# Altium schematic sheet ADC+Temp.SchDoc
size A3; SheetNumber: 5; SheetTotal: 10
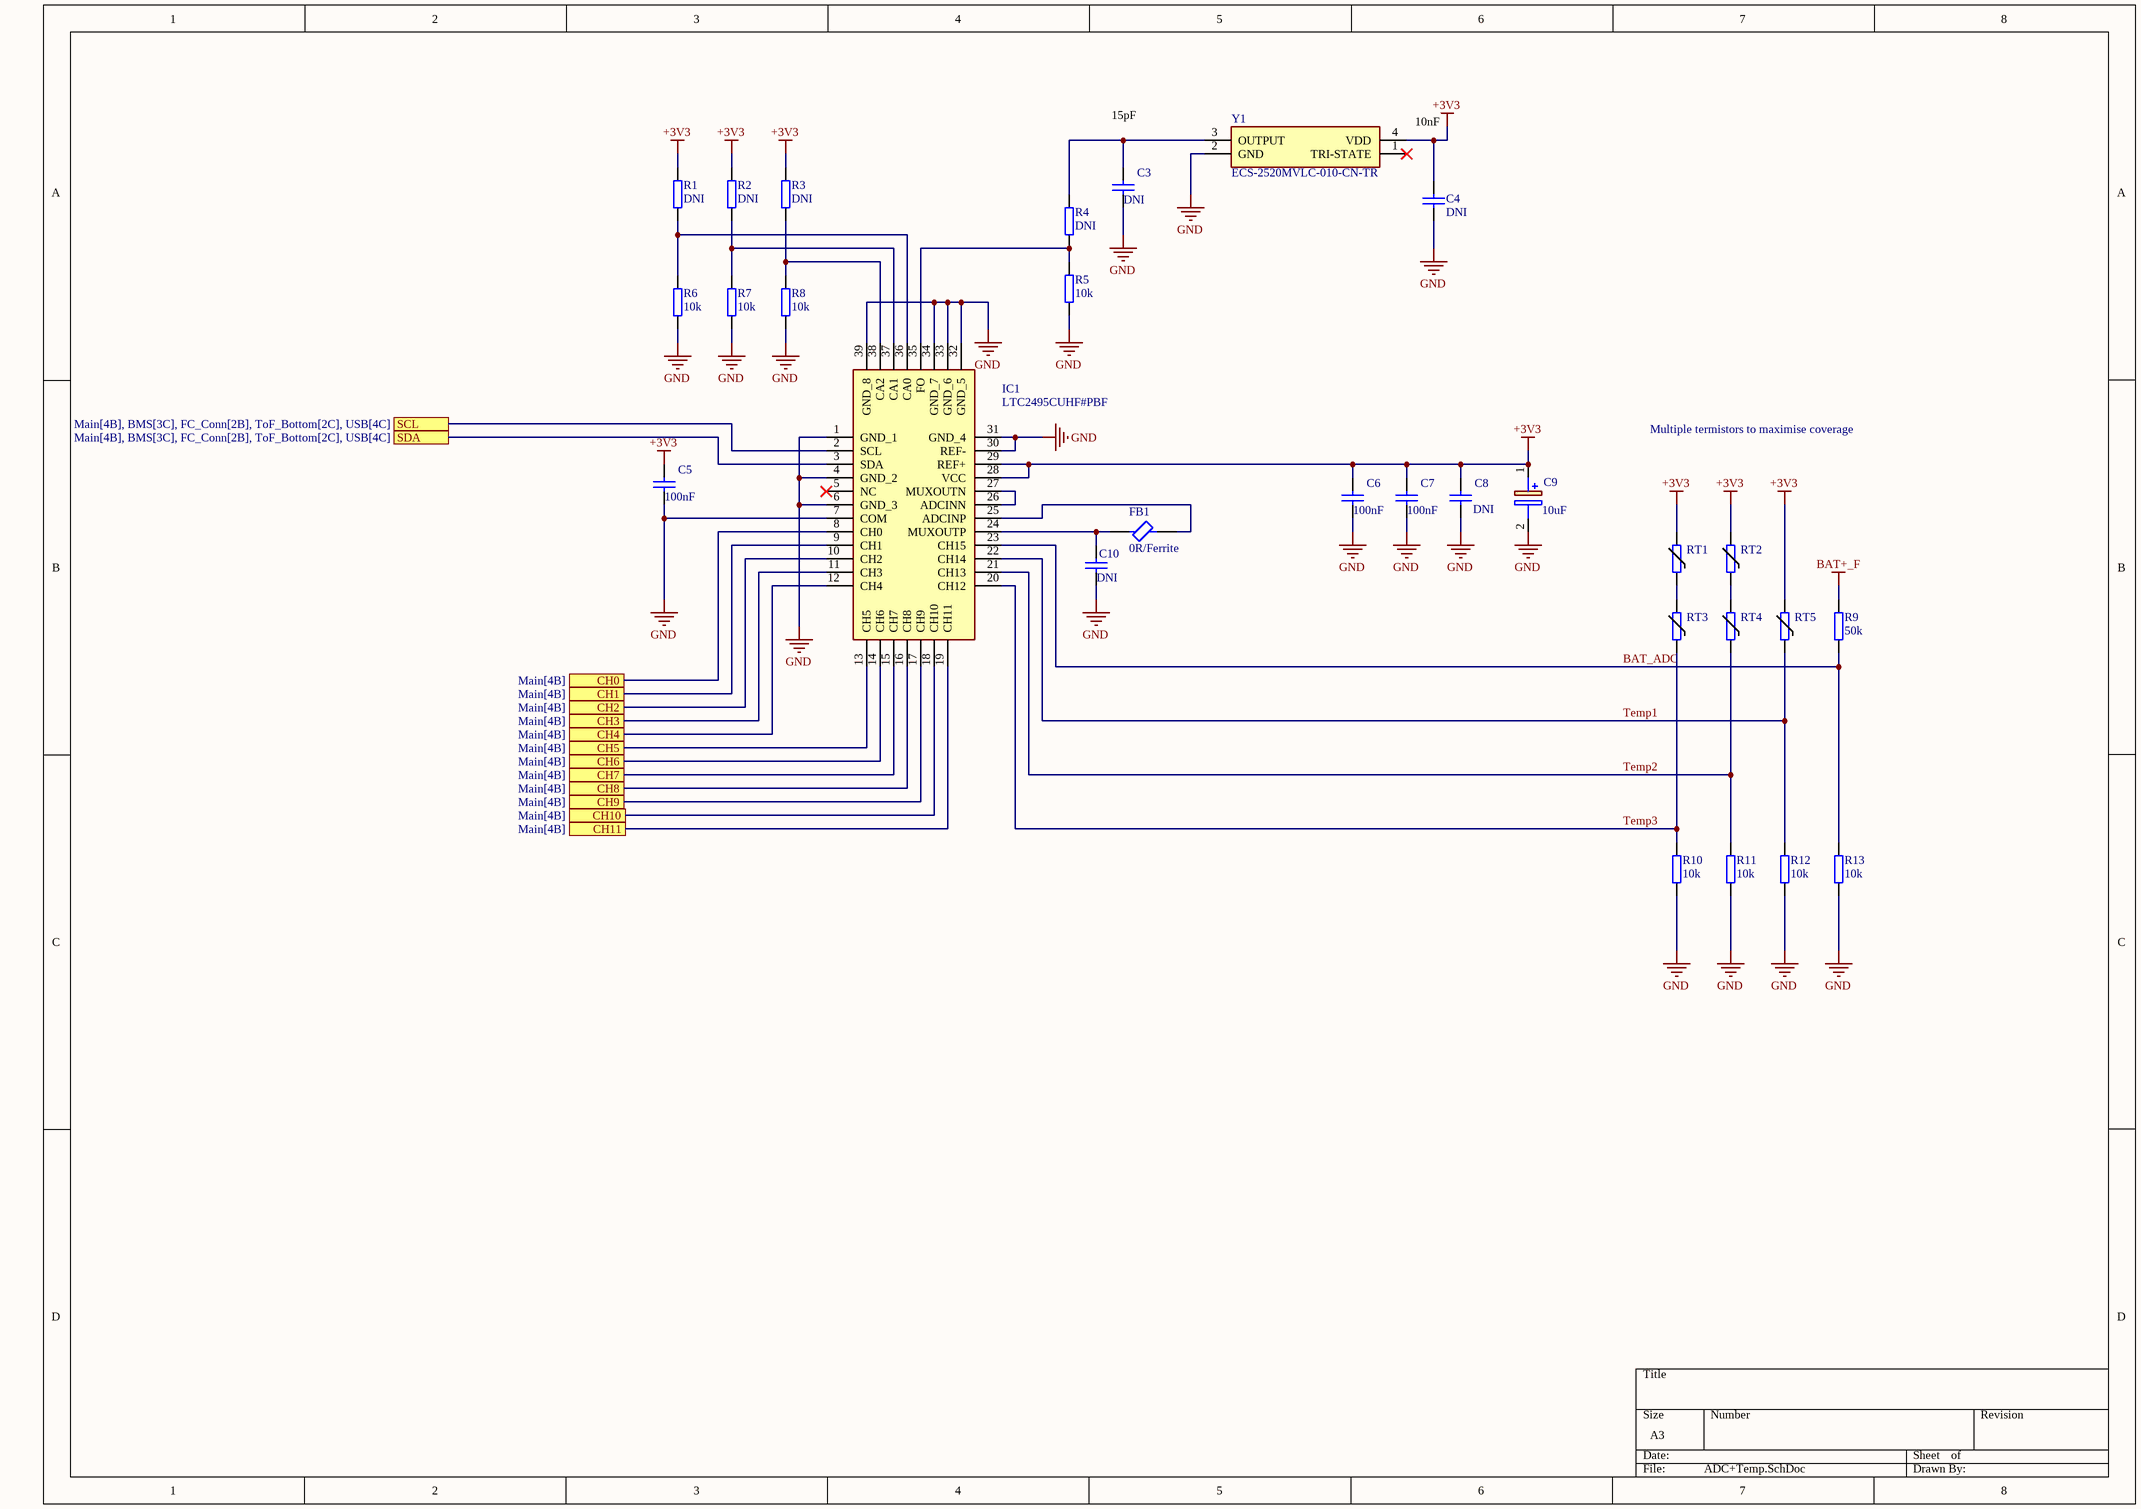
[diagram p0: ADC+Temp.SchDoc]

## Parts
C3  value DNI  [CAP0402]  (hidden comment: Cap0402)
C4  value DNI  [CAP0402]  (hidden comment: Cap0402)
C5  value 100nF  [CAP0402]  (hidden comment: Cap0402)
C6  value 100nF  [CAP0402]  (hidden comment: Cap0402)
C7  value 100nF  [CAP0402]  (hidden comment: Cap0402)
C8  value DNI  [CAP0603]  (hidden comment: Cap0603)
C9  value 10uF  [CAPPC1608X90N]  (hidden comment: TMCJ0J106MTRF)
C10  value DNI  [CAP0402]  (hidden comment: Cap0402)
FB1  0R/Ferrite  [NFZ15SG152SN10B]
IC1  LTC2495CUHF#PBF  [QFN50P500X700X80-39N-D]
R1  value DNI  [RES0402]  (hidden comment: Res0402)
R2  value DNI  [RES0402]  (hidden comment: Res0402)
R3  value DNI  [RES0402]  (hidden comment: Res0402)
R4  value DNI  [RES0402]  (hidden comment: Res0402)
R5  value 10k  [RES0402]  (hidden comment: Res0402)
R6  value 10k  [RES0402]  (hidden comment: Res0402)
R7  value 10k  [RES0402]  (hidden comment: Res0402)
R8  value 10k  [RES0402]  (hidden comment: Res0402)
R9  value 50k  [RES0402]  (hidden comment: Res0402)
R10  value 10k  [RES0402]  (hidden comment: Res0402)
R11  value 10k  [RES0402]  (hidden comment: Res0402)
R12  value 10k  [RES0402]  (hidden comment: Res0402)
R13  value 10k  [RES0402]  (hidden comment: Res0402)
RT1  TMP6131DECR  [TMP6131DECR]  (value not drawn)
RT2  TMP6131DECR  [TMP6131DECR]  (value not drawn)
RT3  TMP6131DECR  [TMP6131DECR]  (value not drawn)
RT4  TMP6131DECR  [TMP6131DECR]  (value not drawn)
RT5  TMP6131DECR  [TMP6131DECR]  (value not drawn)
Y1  ECS-2520MVLC-010-CN-TR  [ECS2520MVLC010CNTR]

## Ports
CH0 (see Main[4B]), CH1 (see Main[4B]), CH2 (see Main[4B]), CH3 (see Main[4B]), CH4 (see Main[4B]), CH5 (see Main[4B]), CH6 (see Main[4B]), CH7 (see Main[4B]), CH8 (see Main[4B]), CH9 (see Main[4B]), CH10 (see Main[4B]), CH11 (see Main[4B]), SCL (see Main[4B], BMS[3C], FC_Conn[2B], ToF_Bottom[2C], USB[4C]), SDA (see Main[4B], BMS[3C], FC_Conn[2B], ToF_Bottom[2C], USB[4C])

## Nets
+3V3: C4.2 C5.2 C6.2 C7.2 C8.2 C9.1(+) IC1.28(VCC) IC1.29(REF+) R1.2 R2.2 R3.2 RT1.2 RT2.2 RT5.2 Y1.4(VDD)
BAT+_F: R9.2
GND: C3.1 C4.1 C5.1 C6.1 C7.1 C8.1 C9.2(-) C10.1 IC1.1(GND_1) IC1.4(GND_2) IC1.6(GND_3) IC1.7(COM) IC1.30(REF-) IC1.31(GND_4) IC1.32(GND_5) IC1.33(GND_6) IC1.34(GND_7) IC1.39(GND_8) R5.1 R6.1 R7.1 R8.1 R10.1 R11.1 R12.1 R13.1 Y1.2(GND)
BAT_ADC: IC1.23(CH15) R9.1 R13.2
CH0: IC1.8(CH0) ; port CH0
CH1: IC1.9(CH1) ; port CH1
CH2: IC1.10(CH2) ; port CH2
CH3: IC1.11(CH3) ; port CH3
CH4: IC1.12(CH4) ; port CH4
CH5: IC1.13(CH5) ; port CH5
CH6: IC1.14(CH6) ; port CH6
CH7: IC1.15(CH7) ; port CH7
CH8: IC1.16(CH8) ; port CH8
CH9: IC1.17(CH9) ; port CH9
CH10: IC1.18(CH10) ; port CH10
CH11: IC1.19(CH11) ; port CH11
SCL: IC1.2(SCL) ; port SCL
SDA: IC1.3(SDA) ; port SDA
Temp1: IC1.22(CH14) R12.2 RT5.1
Temp2: IC1.21(CH13) R11.2 RT4.1
Temp3: IC1.20(CH12) R10.2 RT3.1
NetC3_2: C3.2 R4.2 Y1.3(OUTPUT)
NetC10_2: C10.2 FB1.1 IC1.24(MUXOUTP)
NetFB1_2: FB1.2 IC1.25(ADCINP)
NetIC1_26: IC1.26(ADCINN) IC1.27(MUXOUTN)
NetIC1_35: IC1.35(FO) R4.1 R5.2
NetIC1_36: IC1.36(CA0) R1.1 R6.2
NetIC1_37: IC1.37(CA1) R2.1 R7.2
NetIC1_38: IC1.38(CA2) R3.1 R8.2
NetRT1_1: RT1.1 RT3.2
NetRT2_1: RT2.1 RT4.2

Not connected (* = marked no-connect by the designer): IC1 5(NC)*; Y1 1(TRI-STATE)*

## Notes on the sheet
- 15pF
- (near Y1) 10nF
- Multiple termistors to maximise coverage

## Library data of the parts
C5-C7 = Cap0402: Manufacturer_Part_Number: GRM155R71H104ME14D; Voltage: 50V
C9 = 298D106X96R3M2T: Capacitor Polarised; Voltage: 6V3; Manufacturer_Part_Number: TMCJ0J106MTRF
FB1 = BLM15PE471SH1D: Ferrite Bead; Manufacturer_Name: Murata Electronics; Datasheet Link: https://www.murata.com/en-global/products/productdetail.aspx?cate=luNoiseSupprFilteChipFerriBead&partno=BLM15PE471SH1%23; Height: 0.55mm; Manufacturer_Part_Number: BLM15PE471SH1D; Mouser Part Number: 81-BLM15PE471SH1D; Mouser Price/Stock: https://www.mouser.co.uk/ProductDetail/Murata-Electronics/BLM15PE471SH1D?qs=DRkmTr78QATAY5qAVx1hGA%3D%3D
IC1 = LTC2495CUHF#PBF: Integrated Circuit; Manufacturer_Name: Analog Devices; Datasheet Link: https://www.analog.com/media/en/technical-documentation/data-sheets/2495fe.pdf; Height: 0.8mm; Manufacturer_Part_Number: LTC2495CUHF#PBF; Mouser Part Number: 584-LTC2495CUHF#PBF; Mouser Price/Stock: https://www.mouser.co.uk/ProductDetail/Analog-Devices/LTC2495CUHFPBF?qs=hVkxg5c3xu%252Bd9nHQ1gaMcw%3D%3D; Arrow Part Number: LTC2495CUHF#PBF; Arrow Price/Stock: https://www.arrow.com/en/products/ltc2495cuhfpbf/analog-devices?region=europe
R5-R8 R10-R13 = Res0402: Manufacturer_Part_Number: ERA-2AED103X
R9 = Res0402: Manufacturer_Part_Number: TNPW040249K9DEED
RT1-RT5 = TMP6131DECR: Integrated Circuit; Manufacturer_Name: Texas Instruments; Datasheet Link: http://www.ti.com/lit/gpn/TMP61; Height: 0.5mm; Manufacturer_Part_Number: TMP6131DECR; Mouser Part Number: 595-TMP6131DECR; Mouser Price/Stock: https://www.mouser.co.uk/ProductDetail/Texas-Instruments/TMP6131DECR?qs=l7cgNqFNU1jnXQehRCOLwA%3D%3D; Arrow Part Number: TMP6131DECR; Arrow Price/Stock: https://www.arrow.com/en/products/tmp6131decr/texas-instruments?region=nac
Y1 = ECS-2520MVLC-010-CN-TR: Crystal or Oscillator; Manufacturer_Name: ECS; Datasheet Link: https://ecsxtal.com/store/pdf/ECS-2520MVLC.pdf; Height: 0.9mm; Manufacturer_Part_Number: ECS-2520MVLC-010-CN-TR; Mouser Part Number: 520-2520MVLC-010CNTR; Mouser Price/Stock: https://www.mouser.co.uk/ProductDetail/ECS/ECS-2520MVLC-010-CN-TR?qs=vvQtp7zwQdMouzumdpJOhQ%3D%3D
C3 C4 C10 = Cap0402: Voltage: DNI
C8 = Cap0603: Voltage: DNI